# Altium schematic sheet STM32F.SchDoc
size A4; SheetNumber: 1; SheetTotal: 2
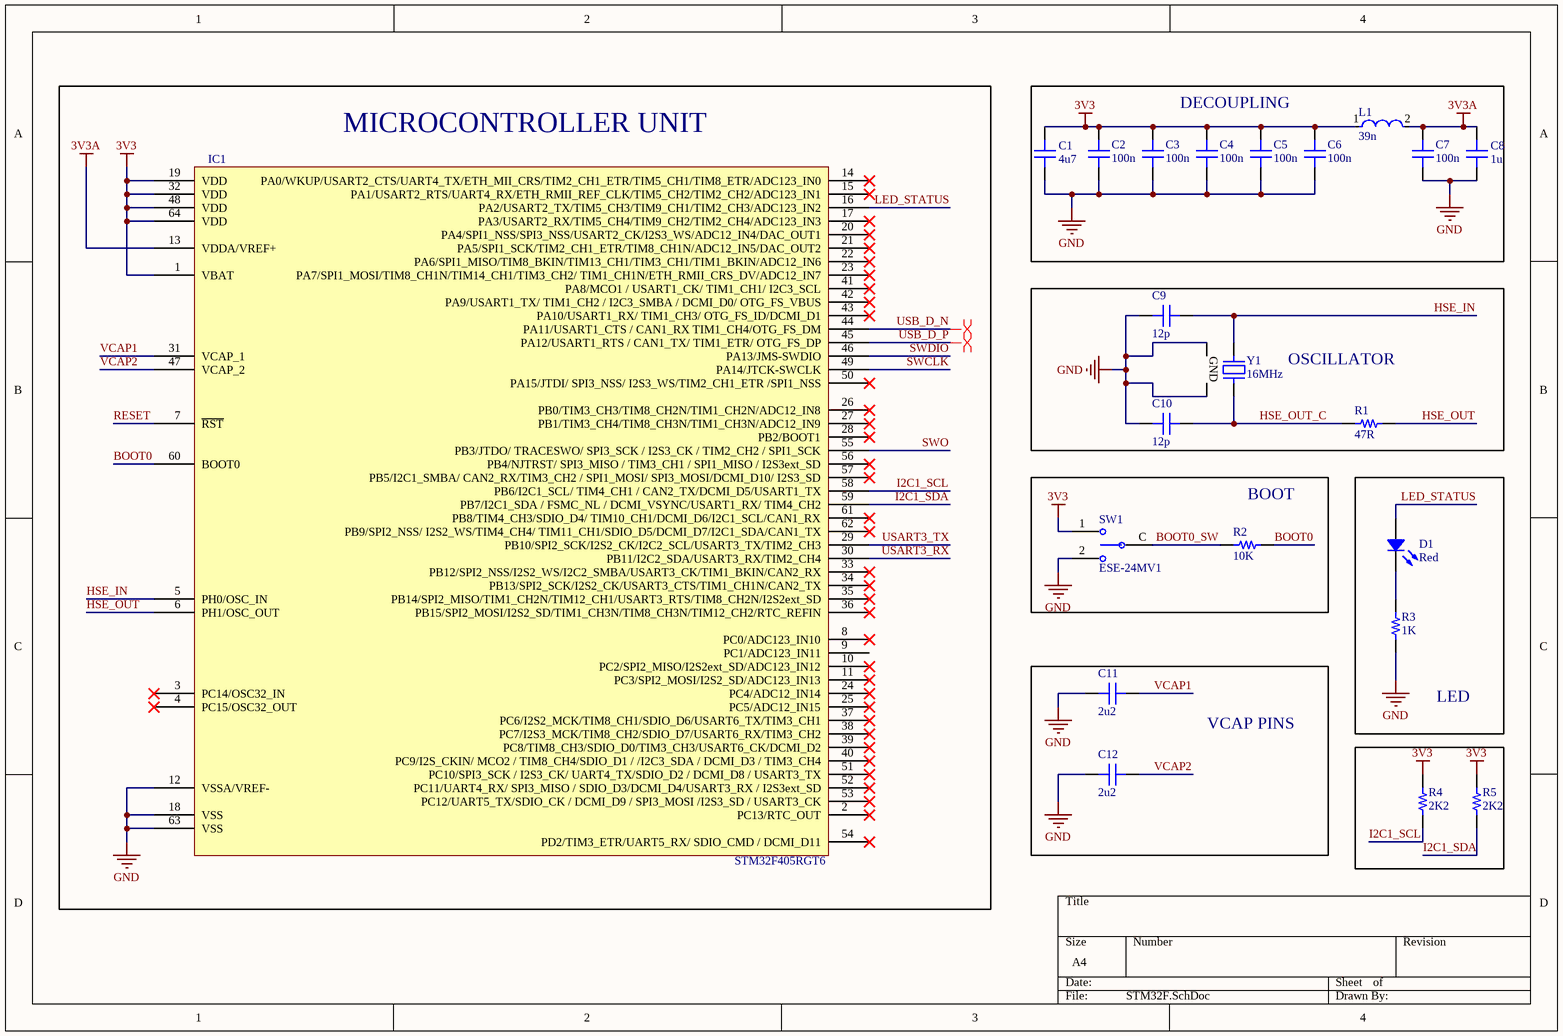
[diagram p0: STM32F.SchDoc]

## Parts
C1  4u7  [CAP 0805_2012]
C2  100n  [CAP 0603_1608]
C3  100n  [CAP 0603_1608]
C4  100n  [CAP 0603_1608]
C5  100n  [CAP 0603_1608]
C6  100n  [CAP 0603_1608]
C7  100n  [CAP 0603_1608]
C8  1u  [CAP 0805_2012]
C9  12p  [CAP 0603_1608]
C10  12p  [CAP 0603_1608]
C11  2u2  [CAP 0603_1608]
C12  2u2  [CAP 0603_1608]
D1  Red  [LED 0603_1608 RED]
IC1  STM32F405RGT6  [ST LQFP-64 10X10MM]
L1  39n  [FP-LQW18AN_00-MFG]
R1  47R  [RES 0603_1608]
R2  10K  [RES 0603_1608]
R3  1K  [RES 0603_1608]
R4  2K2  [RES 0603_1608]
R5  2K2  [RES 0603_1608]
SW1  ESE-24MV1  [FP-ESE-24MV1-MFG]
Y1  16MHz  [ABRACON ABM10]

## Blocks framed on the sheet
MICROCONTROLLER UNIT: IC1
DECOUPLING: C1-C8 L1
OSCILLATOR: C9 C10 R1 Y1
BOOT: R2 SW1
LED: D1 R3
VCAP PINS: C11 C12

## Nets
3V3: C1.2 C2.2 C3.2 C4.2 C5.2 C6.2 IC1.1(VBAT) IC1.19(VDD) IC1.32(VDD) IC1.48(VDD) IC1.64(VDD) L1.1 R4.2 R5.2 SW1.1
3V3A: C7.2 C8.2 IC1.13(VDDA/VREF+) L1.2
GND: C1.1 C2.1 C3.1 C4.1 C5.1 C6.1 C7.1 C8.1 C9.2 C10.2 C11.2 C12.2 IC1.12(VSSA/VREF-) IC1.18(VSS) IC1.63(VSS) R3.1 SW1.2 Y1.2(GND) Y1.4(GND)
BOOT0: IC1.60(BOOT0) R2.2
BOOT0_SW: R2.1 SW1.C
HSE_IN: C9.1 IC1.5(PH0/OSC_IN) Y1.1
HSE_OUT: IC1.6(PH1/OSC_OUT) R1.2
HSE_OUT_C: C10.1 R1.1 Y1.3
I2C1_SCL: IC1.58(PB6/I2C1_SCL/_TIM4_CH1_/_CAN2_TX/DCMI_D5/USART1_TX) R4.1
I2C1_SDA: IC1.59(PB7/I2C1_SDA_/_FSMC_NL_/_DCMI_VSYNC/USART1_RX/_TIM4_CH2) R5.1
LED_STATUS: D1.1 IC1.16(PA2/USART2_TX/TIM5_CH3/TIM9_CH1/TIM2_CH3/ADC123_IN2)
RESET: IC1.7(~{RST})
SWCLK: IC1.49(PA14/JTCK-SWCLK)
SWDIO: IC1.46(PA13/JMS-SWDIO)
SWO: IC1.55(PB3/JTDO/_TRACESWO/_SPI3_SCK_/_I2S3_CK_/_TIM2_CH2_/_SPI1_SCK)
USART3_RX: IC1.30(PB11/I2C2_SDA/USART3_RX/TIM2_CH4)
USART3_TX: IC1.29(PB10/SPI2_SCK/I2S2_CK/I2C2_SCL/USART3_TX/TIM2_CH3)
USB_D_N: IC1.44(PA11/USART1_CTS_/_CAN1_RX_TIM1_CH4/OTG_FS_DM)
USB_D_P: IC1.45(PA12/USART1_RTS_/_CAN1_TX/_TIM1_ETR/_OTG_FS_DP)
VCAP1: C11.1 IC1.31(VCAP_1)
VCAP2: C12.1 IC1.47(VCAP_2)
NetD1_2: D1.2 R3.2

Not connected (* = marked no-connect by the designer): IC1 2(PC13/RTC_OUT)* 3(PC14/OSC32_IN)* 4(PC15/OSC32_OUT)* 8(PC0/ADC123_IN10)* 9(PC1/ADC123_IN11) 10(PC2/SPI2_MISO/I2S2ext_SD/ADC123_IN12)* 11(PC3/SPI2_MOSI/I2S2_SD/ADC123_IN13)* 14(PA0/WKUP/USART2_CTS/UART4_TX/ETH_MII_CRS/TIM2_CH1_ETR/TIM5_CH1/TIM8_ETR/ADC123_IN0)* 15(PA1/USART2_RTS/UART4_RX/ETH_RMII_REF_CLK/TIM5_CH2/TIM2_CH2/ADC123_IN1)* 17(PA3/USART2_RX/TIM5_CH4/TIM9_CH2/TIM2_CH4/ADC123_IN3)* 20(PA4/SPI1_NSS/SPI3_NSS/USART2_CK/I2S3_WS/ADC12_IN4/DAC_OUT1)* 21(PA5/SPI1_SCK/TIM2_CH1_ETR/TIM8_CH1N/ADC12_IN5/DAC_OUT2)* 22(PA6/SPI1_MISO/TIM8_BKIN/TIM13_CH1/TIM3_CH1/TIM1_BKIN/ADC12_IN6)* 23(PA7/SPI1_MOSI/TIM8_CH1N/TIM14_CH1/TIM3_CH2/_TIM1_CH1N/ETH_RMII_CRS_DV/ADC12_IN7)* 24(PC4/ADC12_IN14)* 25(PC5/ADC12_IN15)* 26(PB0/TIM3_CH3/TIM8_CH2N/TIM1_CH2N/ADC12_IN8)* 27(PB1/TIM3_CH4/TIM8_CH3N/TIM1_CH3N/ADC12_IN9)* 28(PB2/BOOT1)* 33(PB12/SPI2_NSS/I2S2_WS/I2C2_SMBA/USART3_CK/TIM1_BKIN/CAN2_RX)* 34(PB13/SPI2_SCK/I2S2_CK/USART3_CTS/TIM1_CH1N/CAN2_TX)* 35(PB14/SPI2_MISO/TIM1_CH2N/TIM12_CH1/USART3_RTS/TIM8_CH2N/I2S2ext_SD)* 36(PB15/SPI2_MOSI/I2S2_SD/TIM1_CH3N/TIM8_CH3N/TIM12_CH2/RTC_REFIN)* 37(PC6/I2S2_MCK/TIM8_CH1/SDIO_D6/USART6_TX/TIM3_CH1)* 38(PC7/I2S3_MCK/TIM8_CH2/SDIO_D7/USART6_RX/TIM3_CH2)* 39(PC8/TIM8_CH3/SDIO_D0/TIM3_CH3/USART6_CK/DCMI_D2)* 40(PC9/I2S_CKIN/_MCO2_/_TIM8_CH4/SDIO_D1_/_/I2C3_SDA_/_DCMI_D3_/_TIM3_CH4)* 41(PA8/MCO1_/_USART1_CK/_TIM1_CH1/_I2C3_SCL)* 42(PA9/USART1_TX/_TIM1_CH2_/_I2C3_SMBA_/_DCMI_D0/_OTG_FS_VBUS)* 43(PA10/USART1_RX/_TIM1_CH3/_OTG_FS_ID/DCMI_D1)* 50(PA15/JTDI/_SPI3_NSS/_I2S3_WS/TIM2_CH1_ETR_/SPI1_NSS)* 51(PC10/SPI3_SCK_/_I2S3_CK/_UART4_TX/SDIO_D2_/_DCMI_D8_/_USART3_TX)* 52(PC11/UART4_RX/_SPI3_MISO_/_SDIO_D3/DCMI_D4/USART3_RX_/_I2S3ext_SD)* 53(PC12/UART5_TX/SDIO_CK_/_DCMI_D9_/_SPI3_MOSI_/I2S3_SD_/_USART3_CK)* 54(PD2/TIM3_ETR/UART5_RX/_SDIO_CMD_/_DCMI_D11)* 56(PB4/NJTRST/_SPI3_MISO_/_TIM3_CH1_/_SPI1_MISO_/_I2S3ext_SD)* 57(PB5/I2C1_SMBA/_CAN2_RX/TIM3_CH2_/_SPI1_MOSI/_SPI3_MOSI/DCMI_D10/_I2S3_SD)* 61(PB8/TIM4_CH3/SDIO_D4/_TIM10_CH1/DCMI_D6/I2C1_SCL/CAN1_RX)* 62(PB9/SPI2_NSS/_I2S2_WS/TIM4_CH4/_TIM11_CH1/SDIO_D5/DCMI_D7/I2C1_SDA/CAN1_TX)*

## Layout directives
differential pair: USB_D_N, USB_D_P

## Library data of the parts
C1 C8 = C0805C222K4RAC7800: CAP CER 2200PF 16V X7R 0805; manufacturer: KEMET; Tolerance: ±10%; Part Number: C0805C222K4RAC7800; Applications: Bypass, Decoupling; Capacitance: 2200 pF; componentlink1description: Datasheet; componentlink1url: https://api.kemet.com/component-edge/download/datasheet/C0805C222K4RACTU.pdf; componentlink2description: DigiKey Link; componentlink2url: https://www.digikey.com/en/products/detail/kemet/C0805C222K4RAC7800/2212264; Device Package: 0805 (2012 Metric); lastupdated: 2/9/2024 8:15:14 PM; Lifecycle Status: Active; Minimum Order: 1; Mounting Type: Surface Mount, MLCC; Operating Temperature: -55°C ~ 125°C; Package / Case: 0805 (2012 Metric); packaging: TapeAndReel; partid: 40064; Part Status: Active; price: 0.04; series: SMD Comm X7R; Size / Dimension: 0.079" L x 0.049" W (2.00mm x 1.25mm); Supplier 1: DigiKey; Supplier Part Number 1: 399-C0805C222K4RAC7800CT-ND; Temperature Coefficient: X7R; Thickness (Max): 0.035" (0.88mm); Voltage - Rated: 16V
C2-C7 C9-C12 = C0603C104J4RAC7013: CAP CER SMD 0603 .1UF 5% X7R 16V; manufacturer: KEMET; Capacitance: 0.1 µF; Part Number: C0603C104J4RAC7013; Applications: Bypass, Decoupling; componentlink1description: Datasheet; componentlink1url: https://api.kemet.com/component-edge/download/datasheet/C0603C104J4RAC7013.pdf; componentlink2description: DigiKey Link; componentlink2url: https://www.digikey.com/en/products/detail/kemet/C0603C104J4RAC7013/8572406; Device Package: 0603 (1608 Metric); lastupdated: 2/9/2024 8:10:13 PM; Lifecycle Status: Active; Minimum Order: 1; Mounting Type: Surface Mount, MLCC; Operating Temperature: -55°C ~ 125°C; Package / Case: 0603 (1608 Metric); packaging: TapeAndReel; partid: 40484; Part Status: Active; price: 0.02; series: SMD Comm X7R; Size / Dimension: 0.063" L x 0.031" W (1.60mm x 0.80mm); Supplier 1: DigiKey; Supplier Part Number 1: 399-17571-1-ND; Temperature Coefficient: X7R; Thickness (Max): 0.037" (0.95mm); Tolerance: ±5%; Voltage - Rated: 16V
  C2-C7: Value: 100n
  C9 C10: Value: 12p
  C11 C12: Value: 2u2
D1 = APT1608SEC/J3-AMT: LED RED 0603; Manufacturer: Kingbright; Current - Test: 20mA; Lens Color: Colorless; Lens Size: 1.60mm x 0.80mm; Lens Style: Rectangle with Flat Top; Lens Transparency: Clear; Millicandela Rating: 900mcd; Viewing Angle: 120°; Voltage - Forward (Vf) (Typ): 2.2V; Wavelength - Dominant: 623nm; Wavelength - Peak: 640nm; Part Number: APT1608SEC/J3-AMT; Color: Red; ComponentLink1Description: Datasheet; ComponentLink1URL: https://www.kingbrightusa.com/images/catalog/SPEC/APT1608SEC-J3-AMT.pdf; ComponentLink2Description: DigiKey Link; ComponentLink2URL: https://www.digikey.com/en/products/detail/kingbright/APT1608SEC-J3-AMT/17969025; Device Package: 0603 (1608 Metric); Height (Max): 0.85mm; LastUpdated: 2/8/2024 9:32:15 PM; Lifecycle Status: Active; Minimum Order: 1; Mounting Type: Surface Mount; Package / Case: 0603 (1608 Metric); Packaging: TapeAndReel; PartId: 1301; Part Status: Active; Price: 0.23; Series: High Temp; Size / Dimension: 1.60mm L x 0.85mm W; Supplier 1: DigiKey; Supplier Part Number 1: 754-APT1608SEC/J3-AMTCT-ND; Supplier Device Package: 0603; Value: Red
IC1 = STM32F405RGT6: IC MCU 32BIT 1MB FLASH 64LQFP; Manufacturer: STMicroelectronics; Connectivity: CANbus, I²C, IrDA, LINbus, SPI, UART/USART, USB OTG; Core Processor: ARM® Cortex®-M4; Core Size: 32-Bit; Data Converters: A/D 16x12b; D/A 2x12b; Number of I/O: 51; Oscillator Type: Internal; Peripherals: Brown-out Detect/Reset, DMA, I²S, LCD, POR, PWM, WDT; Program Memory Size: 1MB (1M x 8); RAM Size: 192K x 8; Speed: 168MHz; Voltage - Supply (Vcc/Vdd): 1.8V ~ 3.6V; Part Number: STM32F405RGT6; ComponentLink1Description: Datasheet; ComponentLink1URL: http://www.st.com/content/ccc/resource/technical/document/datasheet/ef/92/76/6d/bb/c2/4f/f7/DM00037051.pdf/files/DM00037051.pdf/jcr:content/translations/en.DM00037051.pdf; ComponentLink2Description: DigiKey Link; ComponentLink2URL: //digikey.com/product-detail/en/stmicroelectronics/STM32F405RGT6/497-11767-ND/2754208; Device Package: 64-LQFP; LastUpdated: 12/5/2019 11:44:20 PM; Lifecycle Status: 0; Minimum Order: 1; Mounting Type: Surface Mount; Operating Temperature: -40°C ~ 85°C (TA); Package / Case: 64-LQFP; Packaging: Tray; PartId: 115; Part Status: Active; Price: 10.30; Program Memory Type: FLASH; Series: STM32F4; Supplier 1: DigiKey; Supplier Part Number 1: 497-11767-ND; Supplier Device Package: 64-LQFP (10x10)
L1 = CMP-06042-008736-1: Wire Wound RF Inductor 39nH ±2% 400mA 0.26Ω 0603 (1608); Core Material: Non-Magnetic; Test Frequency: 100MHz; Shielding: Unshielded; Q Factor: 40; Self Resonant Frequency: 2.8GHz; Current: 370mA; DC Resistance (DCR): 260mR; Package Quantity: 4000; Case/Package: 0603; Resistor Type: Wirewound; Height - Seated (Max): 0.039inch; Lead Free: Lead Free; Min Operating Temperature: -55°C; Case Code (Imperial): 0603; Radiation Hardening: No; Max Operating Temperature: 125°C; Military Standard: Not; Depth: 1mm; Height: 0.8mm; Inductance: 39nH; Case Code (Metric): 1608; Termination: SMD/SMT; Current Rating: 400mA; Max DC Current: 400mA; Tolerance: 2%; Width: 0.031inch; Series Resistance: 260mR; Weight: 0.000106oz; DC Current: 400mA; Length: 1.6mm; Packaging: Tape and Reel; Mount: Surface Mount
R1-R5 = AC0603FR-0747RL: RES SMD 47 OHM 1% 1/10W 0603; Manufacturer: Yageo; Power (Watts): 0.1W, 1/10W; Resistance: 47 Ohms; Temperature Coefficient: ±100ppm/°C; Part Number: AC0603FR-0747RL; ComponentLink1Description: Datasheet; ComponentLink1URL: https://www.yageo.com/upload/media/product/productsearch/datasheet/rchip/PYu-AC_51_RoHS_L_7.pdf; ComponentLink2Description: DigiKey Link; ComponentLink2URL: https://www.digikey.com/en/products/detail/yageo/AC0603FR-0747RL/2827825; Composition: Thick Film; Device Package: 0603 (1608 Metric); Features: Automotive AEC-Q200, Moisture Resistant; Height - Seated (Max): 0.022" (0.55mm); LastUpdated: 2/9/2024 8:42:47 PM; Lifecycle Status: Active; Minimum Order: 1; Number of Terminations: 2; Operating Temperature: -55°C ~ 155°C; Package / Case: 0603 (1608 Metric); Packaging: CutTape; PartId: 17426; Part Status: Active; Price: 0.01; Ratings: AEC-Q200; Series: AC; Size / Dimension: 0.063" L x 0.031" W (1.60mm x 0.80mm); Supplier 1: DigiKey; Supplier Part Number 1: 311-47LDCT-ND; Supplier Device Package: 0603; Tolerance: ±1%
  R1: Value: 47R
  R2: Value: 10K
  R3: Value: 1K
  R4 R5: Value: 2K2
SW1 = CMP-05617-000023-1: SWITCH DETECTOR SPDT 10MA 5V; Operating Force: 0.35N; Actuator Type: Toggle; Operating Position: 0.317inch; Mechanical Life: 50000Cycles; Contact Resistance: 500mR; Body Depth: 3mm; Actuator Length: 2.95mm; Switch Function: Mom-Off-Mom; Body Length: 7.5mm; Body Height: 5.6mm; Number of Terminals/Pins: 3; Case/Package: SMD/SMT; Throw Configuration: SPDT; RoHS Compliant: Yes; Current Rating: 10mA; Mount: Surface Mount; Number of Pins: 3; Termination: SMD/SMT; Packaging: Bulk; Max Voltage Rating (DC): 5V; REACH SVHC: No SVHC; Width: 3mm; Orientation: Straight; Series: ESE24; Height: 5.6mm; Lead Free: Lead Free; Voltage Rating (DC): 5V; Package Quantity: 1000; Min Operating Temperature: -10°C; Electrical Life: 50000Cycles; Max Operating Temperature: 70°C
Y1 = ABM10-16.000MHZ-E20-T: CRYSTAL 16.0000MHZ 10PF SMD; Manufacturer: Abracon LLC; ESR (Equivalent Series Resistance): 150 Ohms; Frequency Stability: ±20ppm; Operating Mode: Fundamental; Part Number: ABM10-16.000MHZ-E20-T; ComponentLink1Description: Datasheet; ComponentLink1URL: https://abracon.com/Resonators/ABM10.pdf; ComponentLink2Description: DigiKey Link; ComponentLink2URL: http://digikey.com/product-detail/en/abracon-llc/ABM10-16.000MHZ-E20-T/535-9810-1-ND/2001433; Device Package: 4-SMD, No Lead; Frequency: 16MHz; Frequency Tolerance: ±20ppm; Height - Seated (Max): 0.028" (0.70mm); LastUpdated: 3/19/2020 10:27:46 PM; Lifecycle Status: Active; Load Capacitance: 10pF; Minimum Order: 1; Mounting Type: Surface Mount; Operating Temperature: -20°C ~ 70°C; Package / Case: 4-SMD, No Lead; Packaging: TapeAndReel; PartId: 278; Part Status: Active; Price: 0.96; Series: ABM10; Size / Dimension: 0.098" L x 0.079" W (2.50mm x 2.00mm); Supplier 1: DigiKey; Supplier Part Number 1: 535-9810-1-ND; Type: MHz Crystal; Value: 16MHz